# EasyEDA schematic Flight control computer.json

## Sheets
1 power and programming: TITLE: Flight Control; REV: 1.0; Date: 2021-09-09; Sheet: 1/1; Drawn By: Michael Kimani & sg; Company: Nakuja project
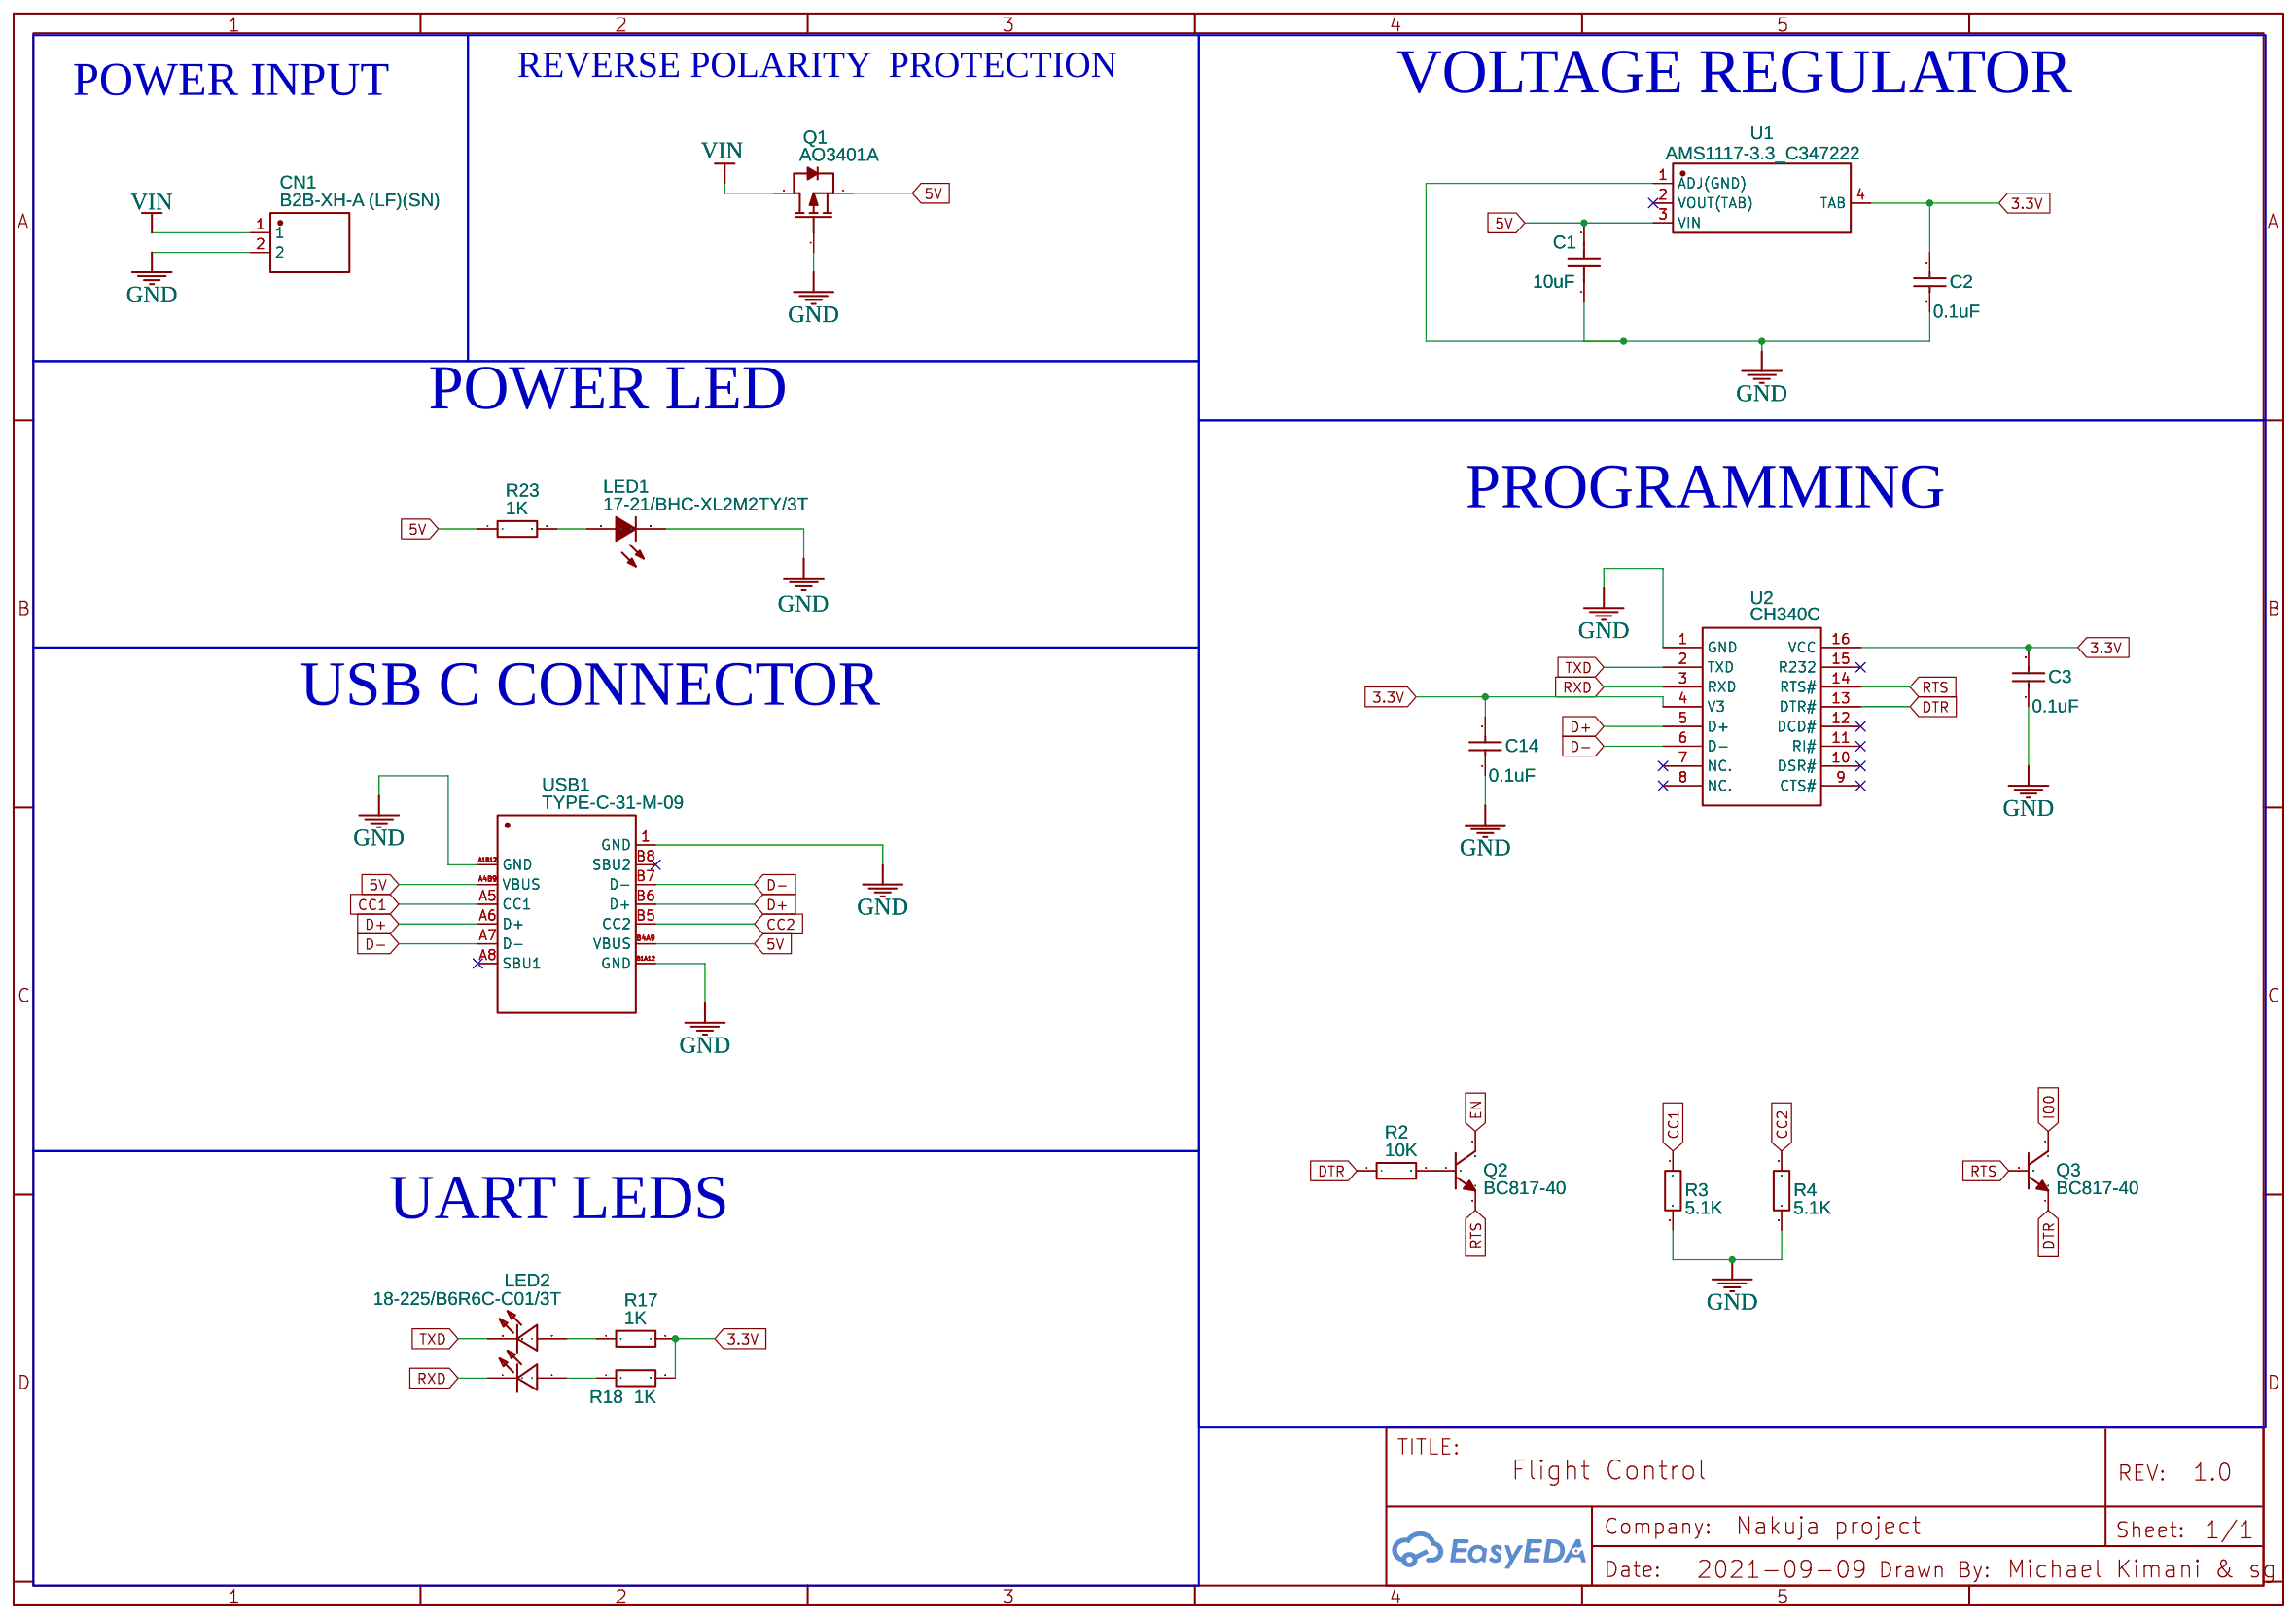
[diagram p0: power and programming]
2 indicators imu and pwmpins: Date: 2021-10-03; Company: Nakuja Project
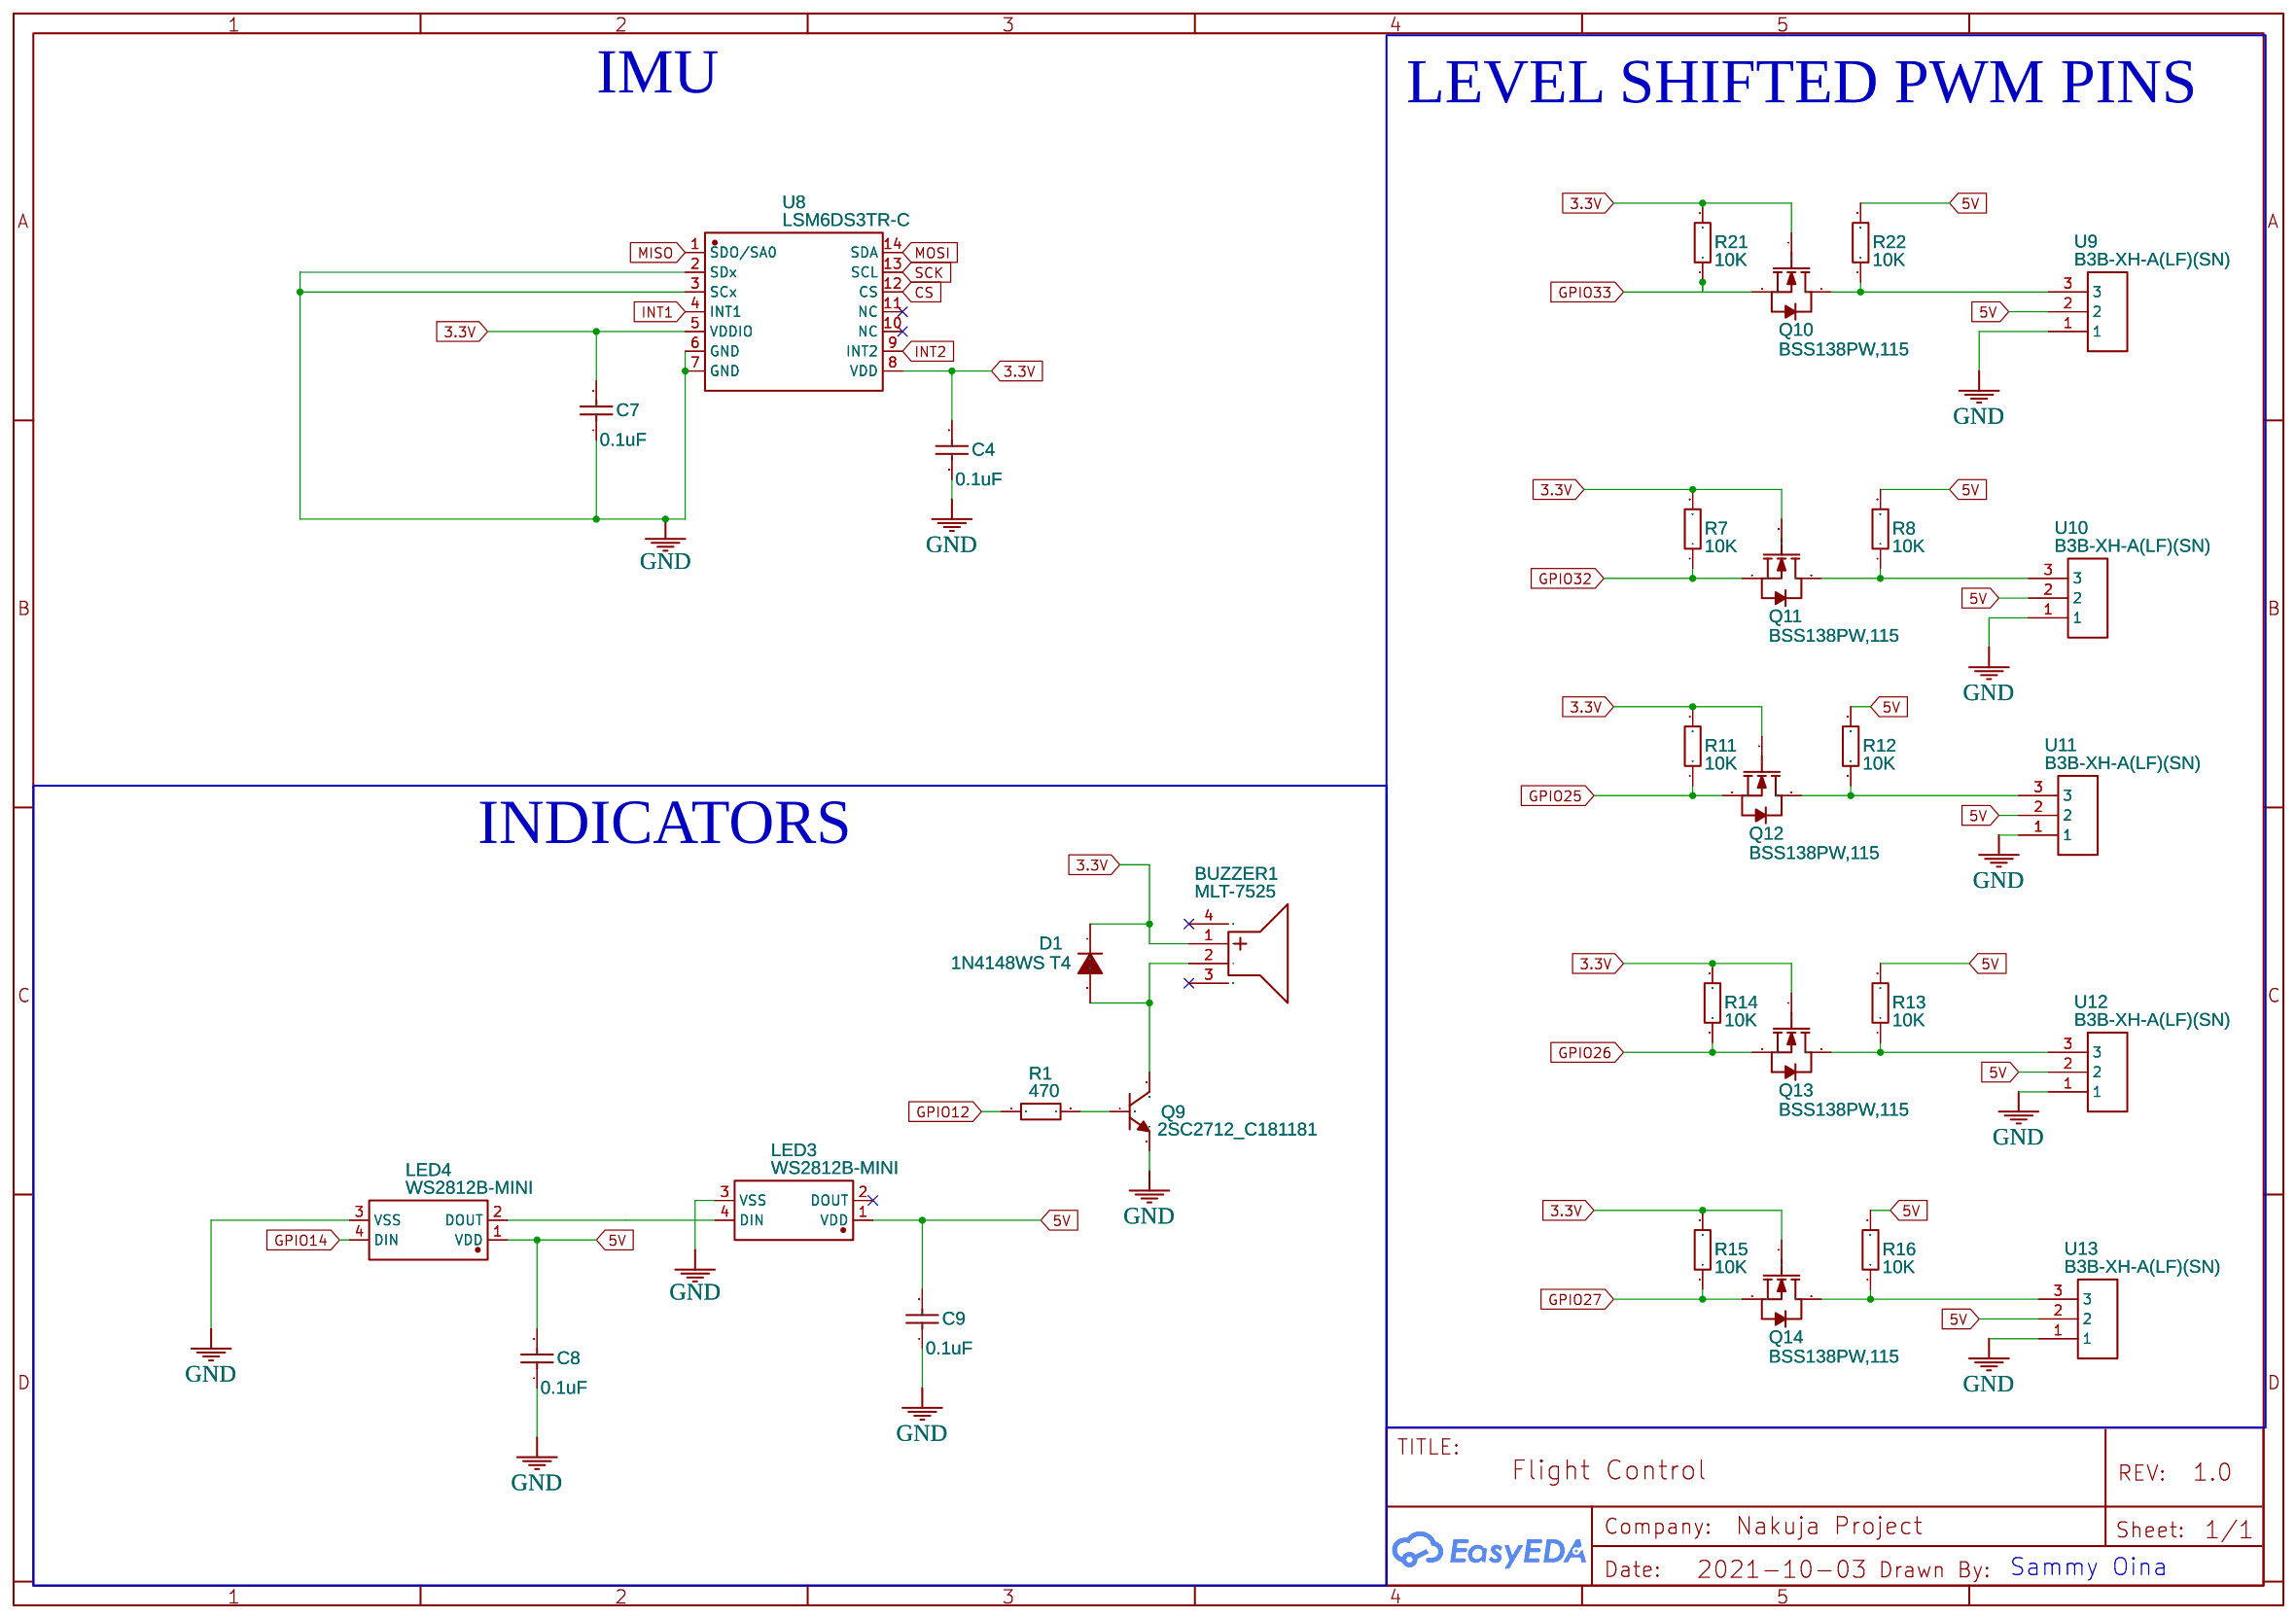
[diagram p1: indicators imu and pwmpins]
3 microcontroller: Date: 2022-02-01; Drawn By: Rodney Osodo; Company: Nakuja Project
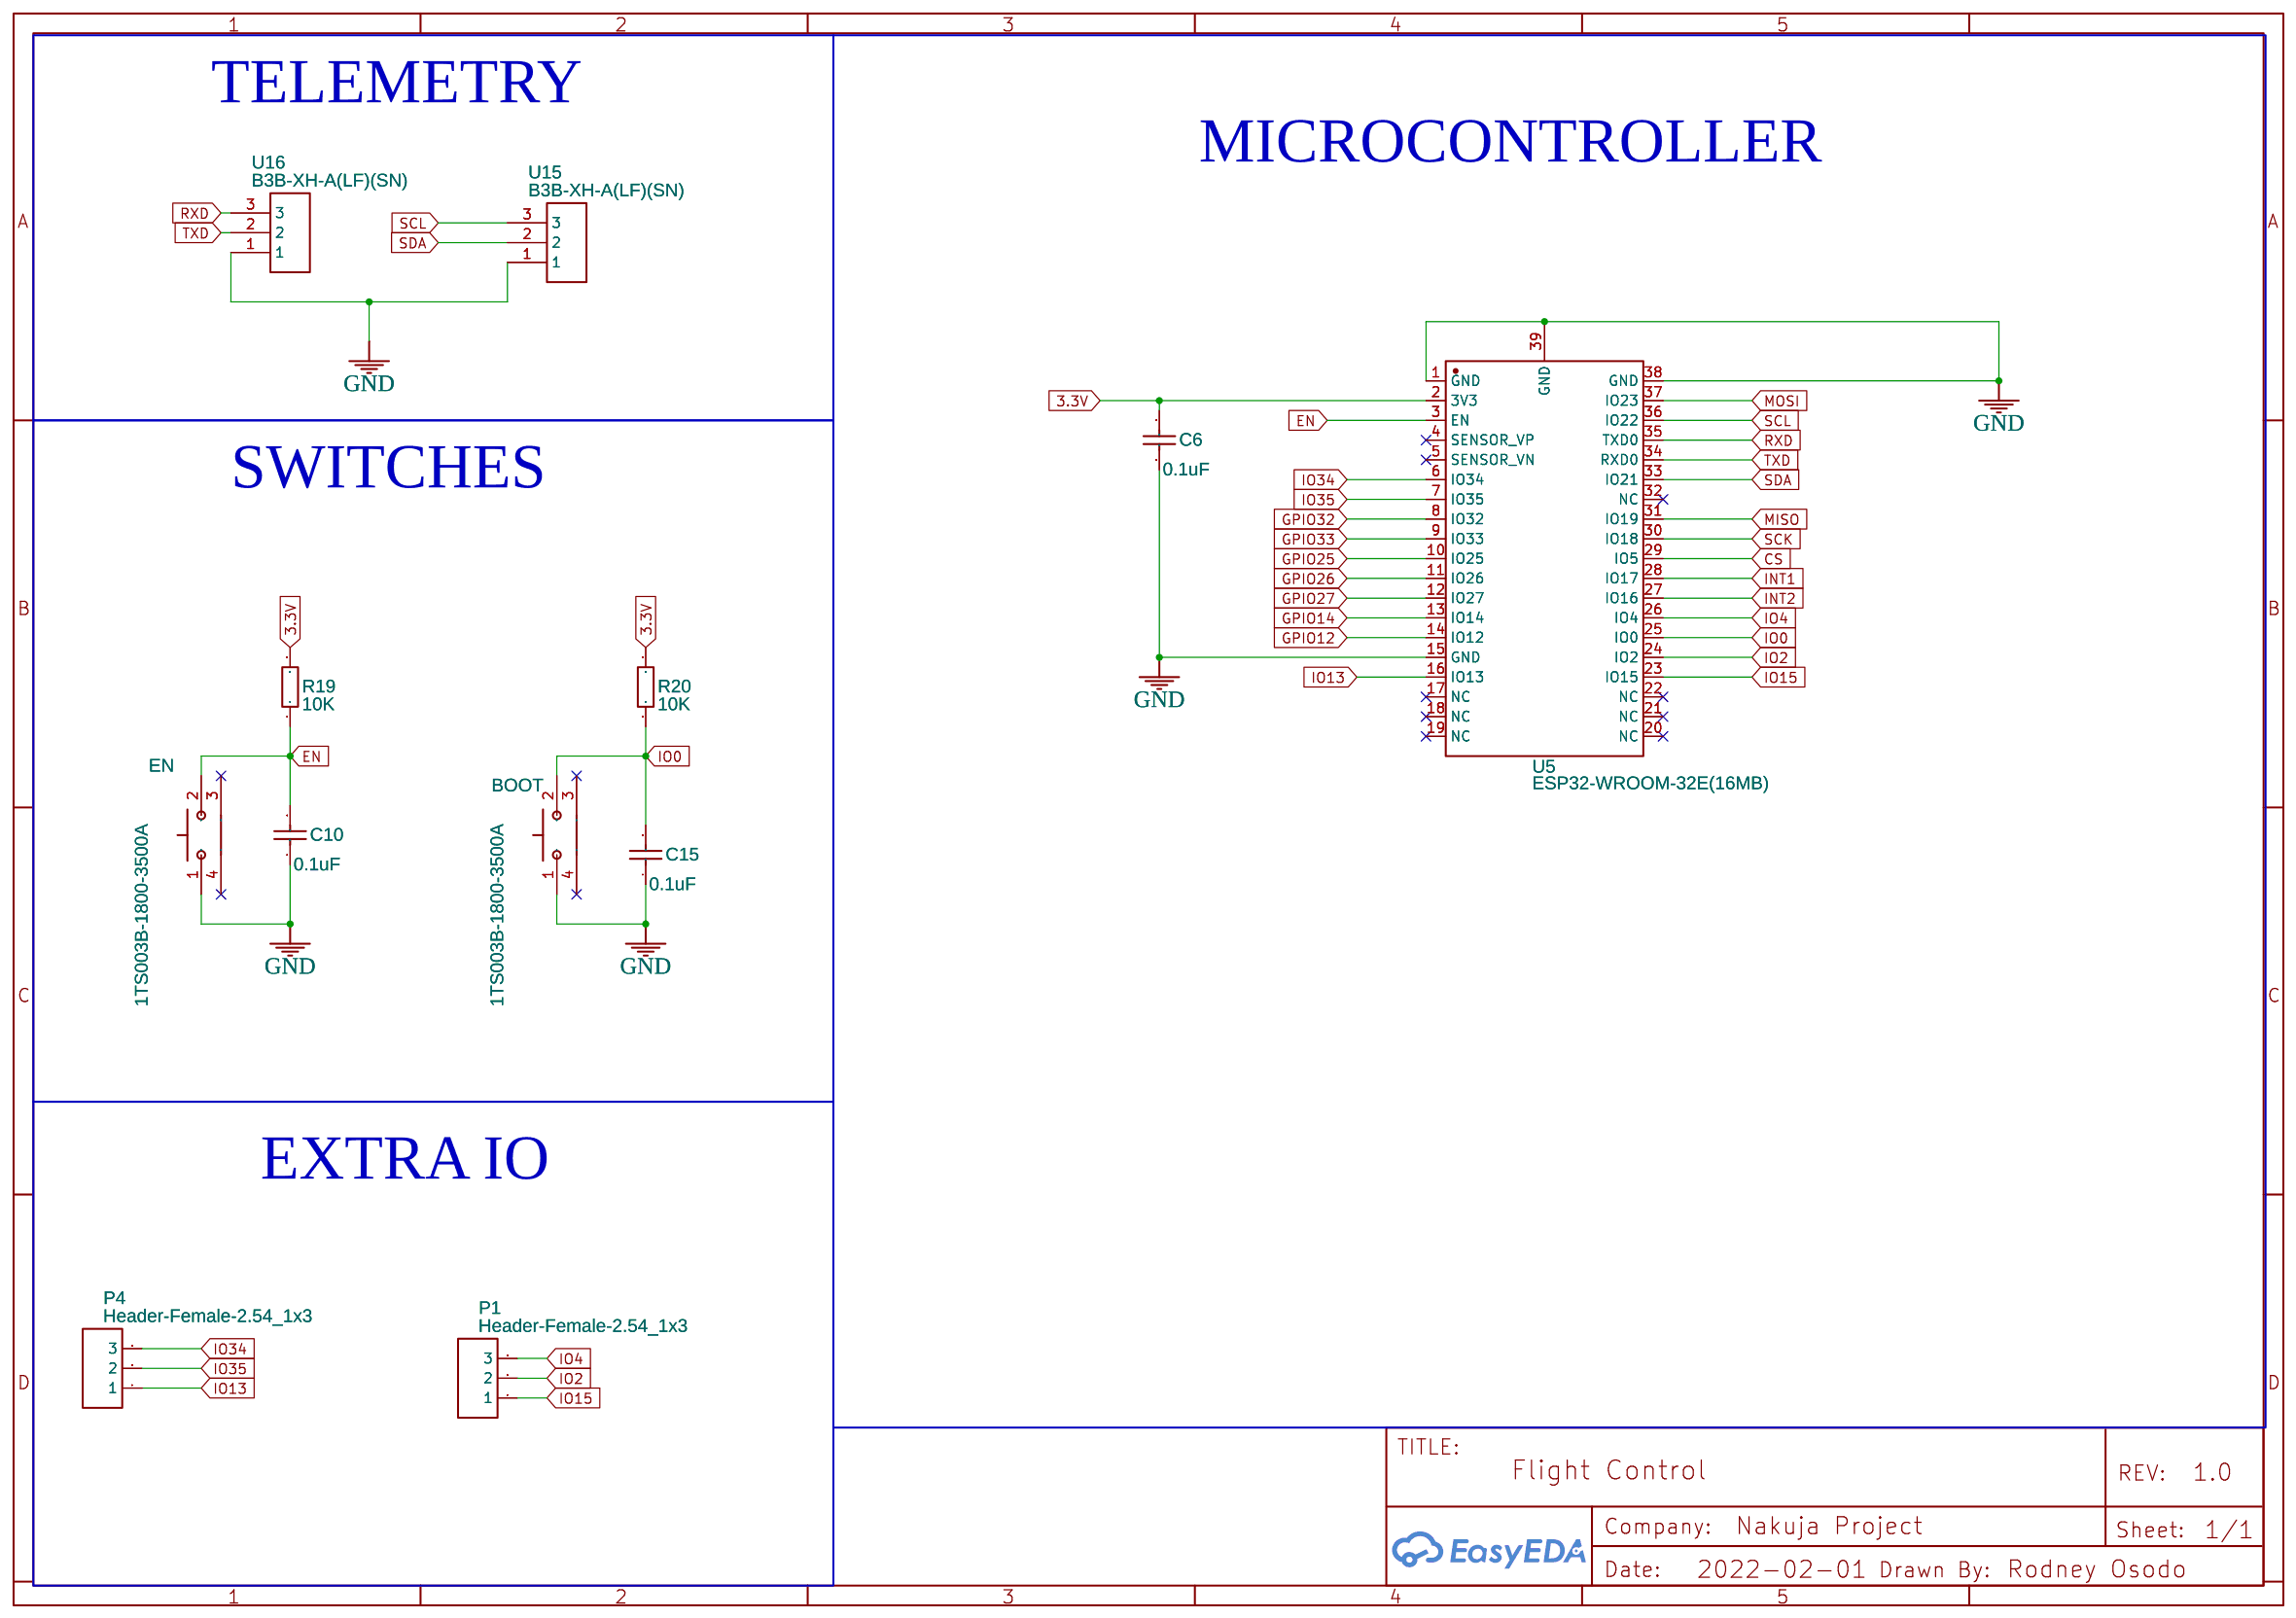
[diagram p2: microcontroller]

## Parts
sheet indicators imu and pwmpins
BUZZER1  MLT-7525  [BUZ-SMD_4P-L7.5-W7.5-P7.59-TL]
C4  0.1uF  [C0603]
C7  0.1uF  [C0603]
C8  0.1uF  [C0603]
C9  0.1uF  [C0603]
D1  1N4148WS T4  [SOD-323_L1.8-W1.3-LS2.5-RD]
LED3  WS2812B-MINI  [LED-SMD_4P-L3.5-W3.5-TL_WS2812B]
LED4  WS2812B-MINI  [LED-SMD_4P-L3.5-W3.5-TL_WS2812B]
Q9  2SC2712_C181181  [SOT-23-3_L2.9-W1.6-P1.90-LS2.8-BR]
Q10  BSS138PW,115  [SOT-323-3_L2.2-W1.3-P1.30-LS2.1-BL]
Q11  BSS138PW,115  [SOT-323-3_L2.2-W1.3-P1.30-LS2.1-BL]
Q12  BSS138PW,115  [SOT-323-3_L2.2-W1.3-P1.30-LS2.1-BL]
Q13  BSS138PW,115  [SOT-323-3_L2.2-W1.3-P1.30-LS2.1-BL]
Q14  BSS138PW,115  [SOT-323-3_L2.2-W1.3-P1.30-LS2.1-BL]
R1  470  [R0805]
R7  10K  [R0402]
R8  10K  [R0402]
R11  10K  [R0402]
R12  10K  [R0402]
R13  10K  [R0402]
R14  10K  [R0402]
R15  10K  [R0402]
R16  10K  [R0402]
R21  10K  [R0402]
R22  10K  [R0402]
U8  LSM6DS3TR-C  [LGA-14_L3.0-W2.5-P0.50-TL]
U9  B3B-XH-A(LF)(SN)  [CONN-TH_3P-P2.50_B3B-XH-A-LF-SN]
U10  B3B-XH-A(LF)(SN)  [CONN-TH_3P-P2.50_B3B-XH-A-LF-SN]
U11  B3B-XH-A(LF)(SN)  [CONN-TH_3P-P2.50_B3B-XH-A-LF-SN]
U12  B3B-XH-A(LF)(SN)  [CONN-TH_3P-P2.50_B3B-XH-A-LF-SN]
U13  B3B-XH-A(LF)(SN)  [CONN-TH_3P-P2.50_B3B-XH-A-LF-SN]
sheet microcontroller
BOOT  1TS003B-1800-3500A  [SW-SMD_1TS003B-XXXX-3500A-CT]
C6  0.1uF  [C0603]
C10  0.1uF  [C0603]
C15  0.1uF  [C0603]
EN  1TS003B-1800-3500A  [SW-SMD_1TS003B-XXXX-3500A-CT]
P1  Header-Female-2.54_1x3  [HDR-TH_3P-P2.54-V-F]
P4  Header-Female-2.54_1x3  [HDR-TH_3P-P2.54-V-F]
R19  10K  [R0402]
R20  10K  [R0402]
U5  ESP32-WROOM-32E(16MB)  [WIFI-SMD_ESP32-WROOM-32E]
U15  B3B-XH-A(LF)(SN)  [CONN-TH_3P-P2.50_B3B-XH-A-LF-SN]
U16  B3B-XH-A(LF)(SN)  [CONN-TH_3P-P2.50_B3B-XH-A-LF-SN]
sheet power and programming
C1  10uF  [C0402]
C2  0.1uF  [C0603]
C3  0.1uF  [C0603]
C14  0.1uF  [C0603]
CN1  B2B-XH-A (LF)(SN)  [CONN-TH_B2B-XH-A-LF-SN]
LED1  17-21/BHC-XL2M2TY/3T  [LED0805-RD]
LED2  18-225/B6R6C-C01/3T  [LED-SMD_4P-L1.6-W0.8-BR-RD]
Q1  AO3401A  [SOT-23_L2.9-W1.3-P1.90-LS2.4-BR]
Q2  BC817-40  [SOT-23-3_L2.9-W1.6-P1.90-LS2.8-BR]
Q3  BC817-40  [SOT-23-3_L2.9-W1.6-P1.90-LS2.8-BR]
R2  10K  [R0402]
R3  5.1K  [R0402]
R4  5.1K  [R0402]
R17  1K  [R0805]
R18  1K  [R0805]
R23  1K  [R0805]
U1  AMS1117-3.3_C347222  [SOT-223_L6.7-W3.5-P2.30-BR]
U2  CH340C  [SOP-16_L10.0-W3.9-P1.27-LS6.0-BL]
USB1  TYPE-C-31-M-09  [USB-C-SMD_TYPE-C-31-M-09]

## Library data of the parts
BUZZER1 = MLT-7525: Supplier: LCSC; Supplier Part: C95299; Manufacturer: Jiangsu Huaneng Elec; Contributor: LCSC; JLCPCB Part Class: Extended Part
C2-C4 C6-C10 C14 C15 = 0603B104K250: Supplier: LCSC; Manufacturer: WTC; Supplier Part: C83054; JLCPCB Part Class: Extended Part
D1 = 1N4148WS T4: Supplier: LCSC; Manufacturer: CJ; Supplier Part: C2128; JLCPCB Part Class: Basic Part
LED3 LED4 = WS2812B-MINI: Supplier: LCSC; Supplier Part: C527089; Manufacturer: Worldsemi; Manufacturer Part: WS2812B-Mini; Contributor: LCSC; JLCPCB Part Class: Extended Part
Q9 = 2SC2712_C181181: Supplier: LCSC; Manufacturer: Hottech; Manufacturer Part: 2SC2712; Contributor: LCSC; Supplier Part: C181181; JLCPCB Part Class: Extended Part
Q10-Q14 = BSS138PW,115: Supplier: LCSC; Supplier Part: C193366; Manufacturer: Nexperia; Contributor: LCSC; JLCPCB Part Class: Extended Part
R1 = 0805W8F4700T5E: Supplier: LCSC; Manufacturer: UniOhm; Supplier Part: C17710; JLCPCB Part Class: Basic Part
R2 R7 R8 R11-R16 R19-R22 = 0402WGJ0103TCE: Supplier: LCSC; Manufacturer: UniOhm; Supplier Part: C25531; JLCPCB Part Class: Extended Part
U8 = LSM6DS3TR-C: Supplier: LCSC; Supplier Part: C967633; Manufacturer: ST(意法半导体); Contributor: LCSC; JLCPCB Part Class: Extended Part
U9-U13 U15 U16 = B3B-XH-A(LF)(SN): Supplier: LCSC; Supplier Part: C144394; Manufacturer: JST Sales America; Contributor: LCSC; JLCPCB Part Class: Extended Part
BOOT EN = 1TS003B-1800-3500A: Supplier: LCSC; Supplier Part: C255809; Manufacturer: HYP; Contributor: LCSC; JLCPCB Part Class: Extended Part; Package Display: No
P1 P4 = Header-Female-2.54_1x3: Supplier Part: C146243; Supplier: LCSC; Manufacturer: Boom Precision Elec; link: https://datasheet.lcsc.com/szlcsc/Boom-Precision-Elec-2-54mm-1-8P-Straight-Female-header_C27438.pdf; JLCPCB Part Class: Extended Part
U5 = ESP32-WROOM-32E(16MB): Supplier: LCSC; Supplier Part: C701343; Manufacturer: Espressif Systems; Contributor: LCSC; JLCPCB Part Class: Extended Part
C1 = CL05A106MQ8NUB8: Supplier: LCSC; Supplier Part: C307416; Manufacturer: Samsung Electro-Mechanics; Contributor: LCSC; JLCPCB Part Class: Extended Part
CN1 = B2B-XH-A (LF)(SN): Supplier: LCSC; Supplier Part: C158012; Manufacturer: JST Sales America; Contributor: LCSC; JLCPCB Part Class: Extended Part
LED1 = 17-21/BHC-XL2M2TY/3T: Supplier: LCSC; Manufacturer: EVERLIGHT; Supplier Part: C72035; JLCPCB Part Class: Extended Part
LED2 = 18-225/B6R6C-C01/3T: Supplier: LCSC; Supplier Part: C282127; Manufacturer: Everlight Elec; Contributor: LCSC; JLCPCB Part Class: Extended Part
Q1 = AO3401A: Supplier: LCSC; Manufacturer: AOS; Supplier Part: C15127; JLCPCB Part Class: Basic Part
Q2 Q3 = BC817-40: Supplier: LCSC; Manufacturer: Hottech; Contributor: LCSC; Supplier Part: C181151; JLCPCB Part Class: Extended Part
R3 R4 = 0402WGF5101TCE: Supplier: LCSC; Manufacturer: UniOhm; Supplier Part: C25905; JLCPCB Part Class: Basic Part
R17 R18 R23 = PTFR0805B1K00N9: Supplier: LCSC; Supplier Part: C328437; Manufacturer: ResistorToday; Contributor: LCSC; JLCPCB Part Class: Extended Part
U1 = AMS1117-3.3_C347222: Supplier: LCSC; Supplier Part: C347222; Manufacturer: Youtai Semiconductor Co., Ltd.; Manufacturer Part: AMS1117-3.3; Contributor: LCSC; JLCPCB Part Class: Extended Part
U2 = CH340C: Supplier: LCSC; Manufacturer: WCH; Supplier Part: C84681; JLCPCB Part Class: Extended Part
USB1 = TYPE-C-31-M-09: Supplier: LCSC; Supplier Part: C2689967; Manufacturer: 韩国韩荣; Contributor: LCSC; JLCPCB Part Class: Extended Part

## Nets
3.3V: BUZZER1.1(+) C2.2 C3.2 C4.2 C6.2 C7.2 C14.2 D1.1(K) Q10.1(G) Q11.1(G) Q12.1(G) Q13.1(G) Q14.1(G) R7.2 R11.2 R14.2 R15.2 R17.2 R18.2 R19.2 R20.2 R21.2 U1.4(TAB) U2.4(V3) U2.16(VCC) U5.2(3V3) U8.5(VDDIO) U8.8(VDD)
5V: C1.2 C8.2 C9.2 LED3.1(VDD) LED4.1(VDD) Q1.2(S) R8.2 R12.2 R13.2 R16.2 R22.2 R23.1 U1.3(VIN) U9.2 U10.2 U11.2 U12.2 U13.2 USB1.A4B9(VBUS) USB1.B4A9(VBUS)
GND: BOOT.1 C1.1 C2.1 C3.1 C4.1 C6.1 C7.1 C8.1 C9.1 C10.1 C14.1 C15.1 CN1.2 EN.1 LED1.1(-) LED3.3(VSS) LED4.3(VSS) Q1.1(G) Q9.2(E) R3.2 R4.2 U1.1(ADJ(GND)) U2.1(GND) U5.1(GND) U5.15(GND) U5.38(GND) U5.39(GND) U8.2(SDx) U8.3(SCx) U8.6(GND) U8.7(GND) U9.1 U10.1 U11.1 U12.1 U13.1 U15.1 U16.1 USB1.1(GND) USB1.A1B12(GND) USB1.B1A12(GND)
VIN: CN1.1 Q1.3(D)
CC1: R3.1 USB1.A5(CC1)
CC2: R4.1 USB1.B5(CC2)
CS: U5.29(IO5) U8.12(CS)
D+: U2.5(D+) USB1.A6(D+) USB1.B6(D+)
D-: U2.6(D-) USB1.A7(D-) USB1.B7(D-)
DTR: Q3.2 R2.1 U2.13(DTR#)
EN: C10.2 EN.2 Q2.3 R19.1 U5.3(EN)
GPIO12: R1.1 U5.14(IO12)
GPIO14: LED4.4(DIN) U5.13(IO14)
GPIO25: Q12.2(S) R11.1 U5.10(IO25)
GPIO26: Q13.2(S) R14.1 U5.11(IO26)
GPIO27: Q14.2(S) R15.1 U5.12(IO27)
GPIO32: Q11.2(S) R7.1 U5.8(IO32)
GPIO33: Q10.2(S) R21.1 U5.9(IO33)
INT1: U5.28(IO17) U8.4(INT1)
INT2: U5.27(IO16) U8.9(INT2)
IO0: BOOT.2 C15.2 Q3.3 R20.1 U5.25(IO0)
IO2: P1.2 U5.24(IO2)
IO4: P1.3 U5.26(IO4)
IO13: P4.1 U5.16(IO13)
IO15: P1.1 U5.23(IO15)
IO34: P4.3 U5.6(IO34)
IO35: P4.2 U5.7(IO35)
MISO: U5.31(IO19) U8.1(SDO/SA0)
MOSI: U5.37(IO23) U8.14(SDA)
RTS: Q2.2 Q3.1 U2.14(RTS#)
RXD: LED2.4 U2.3(RXD) U5.35(TXD0) U16.3
SCK: U5.30(IO18) U8.13(SCL)
SCL: U5.36(IO22) U15.3
SDA: U5.33(IO21) U15.2
TXD: LED2.3 U2.2(TXD) U5.34(RXD0) U16.2
Net-(BUZZER1-2): BUZZER1.2(-) D1.2(A) Q9.3(C)
Net-(LED1-2): LED1.2(+) R23.2
Net-(LED2-1): LED2.1 R18.1
Net-(LED2-2): LED2.2 R17.1
Net-(LED3-4): LED3.4(DIN) LED4.2(DOUT)
Net-(Q2-1): Q2.1 R2.2
Net-(Q9-1): Q9.1(B) R1.2
Net-(Q10-3): Q10.3(D) R22.1 U9.3
Net-(Q11-3): Q11.3(D) R8.1 U10.3
Net-(Q12-3): Q12.3(D) R12.1 U11.3
Net-(Q13-3): Q13.3(D) R13.1 U12.3
Net-(Q14-3): Q14.3(D) R16.1 U13.3

Not connected (* = marked no-connect by the designer): BOOT 3* 4*; BUZZER1 3* 4*; EN 3* 4*; LED3 2(DOUT)*; U1 2(VOUT(TAB))*; U2 7(NC.)* 8(NC.)* 9(CTS#)* 10(DSR#)* 11(RI#)* 12(DCD#)* 15(R232)*; U5 4(SENSOR_VP)* 5(SENSOR_VN)* 17(NC)* 18(NC)* 19(NC)* 20(NC)* 21(NC)* 22(NC)* 32(NC)*; U8 10(NC)* 11(NC)*; USB1 A8(SBU1)* B8(SBU2)*

## Notes on the sheets
sheet 1
- POWER INPUT
- REVERSE POLARITY  PROTECTION
- VOLTAGE REGULATOR
- POWER LED
- PROGRAMMING
- USB C CONNECTOR
- UART LEDS
sheet 2
- IMU
- LEVEL SHIFTED PWM PINS
- INDICATORS
- Sammy Oina
sheet 3
- TELEMETRY
- MICROCONTROLLER
- SWITCHES
- EXTRA IO
